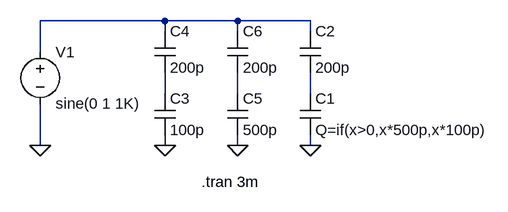
[diagram p0: schematic ArbitraryCapacitance.asc]
ArbitraryCapacitance.asc, the LTspice schematic file:
Version 4
SHEET 1 880 680
WIRE 64 192 64 144
WIRE 64 336 64 272
WIRE 256 144 64 144
WIRE 256 160 256 144
WIRE 256 256 256 224
WIRE 256 336 256 320
WIRE 368 144 256 144
WIRE 368 160 368 144
WIRE 368 256 368 224
WIRE 368 336 368 320
WIRE 480 144 368 144
WIRE 480 160 480 144
WIRE 480 256 480 224
WIRE 480 336 480 320
FLAG 64 336 0
FLAG 480 336 0
FLAG 256 336 0
FLAG 368 336 0
SYMBOL cap 464 256 R0
SYMATTR InstName C1
SYMATTR Value Q=if(x>0,x*500p,x*100p)
SYMBOL voltage 64 176 R0
SYMATTR InstName V1
SYMATTR Value sine(0 1 1K)
SYMBOL cap 464 224 M180
WINDOW 0 24 64 Left 0
WINDOW 3 24 8 Left 0
SYMATTR InstName C2
SYMATTR Value 200p
SYMBOL cap 240 256 R0
SYMATTR InstName C3
SYMATTR Value 100p
SYMBOL cap 240 224 M180
WINDOW 0 24 64 Left 0
WINDOW 3 24 8 Left 0
SYMATTR InstName C4
SYMATTR Value 200p
SYMBOL cap 352 256 R0
SYMATTR InstName C5
SYMATTR Value 500p
SYMBOL cap 352 224 M180
WINDOW 0 24 64 Left 0
WINDOW 3 24 8 Left 0
SYMATTR InstName C6
SYMATTR Value 200p
TEXT 312 392 Left 0 !.tran 3m

The netlist it stands for:
* ArbitraryCapacitance.asc
C1 N004 0 Q=if(x>0,x*500p,x*100p)
V1 N001 0 sine(0 1 1K)
C2 N004 N001 200p
C3 N002 0 100p
C4 N002 N001 200p
C5 N003 0 500p
C6 N003 N001 200p
.tran 3m
.backanno
.end